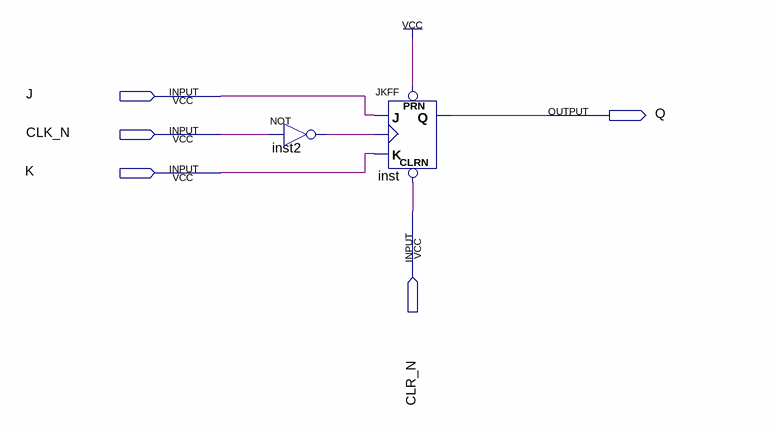
[diagram p0: schematic sheet]
// Quartus schematic FFJK_CLKN.bdf as structural Verilog: 2 symbols, 5 pins
module FFJK_CLKN (
  input  J,
  input  CLK_N,
  input  K,
  input  CLR_N,
  output Q
);

  wire inst2_out;

  not inst2 (inst2_out, CLK_N);
  JKFF inst (.PRN(1'b1), .CLRN(CLR_N), .K(K), .J(J), .CLK(inst2_out), .Q(Q));
endmodule
